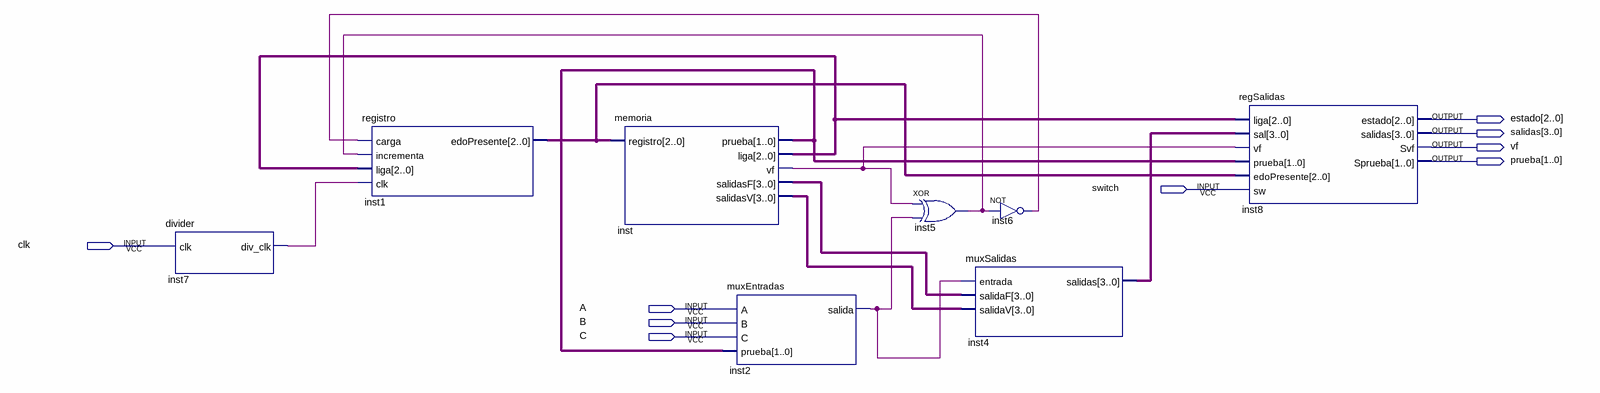
[diagram p0: schematic sheet]
// Quartus schematic practica5.bdf as structural Verilog: 8 symbols, 9 pins
module practica5 (
  input  switch,
  input  clk,
  input  A,
  input  B,
  input  C,
  output [2:0] estado,
  output [3:0] salidas,
  output vf,
  output [1:0] prueba
);

  wire inst2_salida, inst5_out, inst6_out, inst7_div_clk, inst_vf;
  wire [1:0] inst_prueba;
  wire [2:0] inst1_edopresente, inst_liga;
  wire [3:0] inst4_salidas, inst_salidasf, inst_salidasv;

  divider inst7 (.clk(clk), .div_clk(inst7_div_clk));
  registro inst1 (
    .carga(inst6_out), .incrementa(inst5_out), .liga(inst_liga), .clk(inst7_div_clk),
    .edoPresente(inst1_edopresente));
  memoria inst (
    .registro(inst1_edopresente), .prueba(inst_prueba), .liga(inst_liga), .vf(inst_vf),
    .salidasF(inst_salidasf), .salidasV(inst_salidasv));
  muxEntradas inst2 (.A(A), .B(B), .C(C), .prueba(inst_prueba), .salida(inst2_salida));
  xor inst5 (inst5_out, inst_vf, inst2_salida);
  muxSalidas inst4 (.entrada(inst2_salida), .salidaF(inst_salidasf), .salidaV(inst_salidasv), .salidas(inst4_salidas));
  not inst6 (inst6_out, inst5_out);
  regSalidas inst8 (
    .liga(inst_liga), .sal(inst4_salidas), .vf(inst_vf), .prueba(inst_prueba),
    .edoPresente(inst1_edopresente), .sw(switch), .estado(estado), .salidas(salidas), .Svf(vf),
    .Sprueba(prueba));
endmodule
